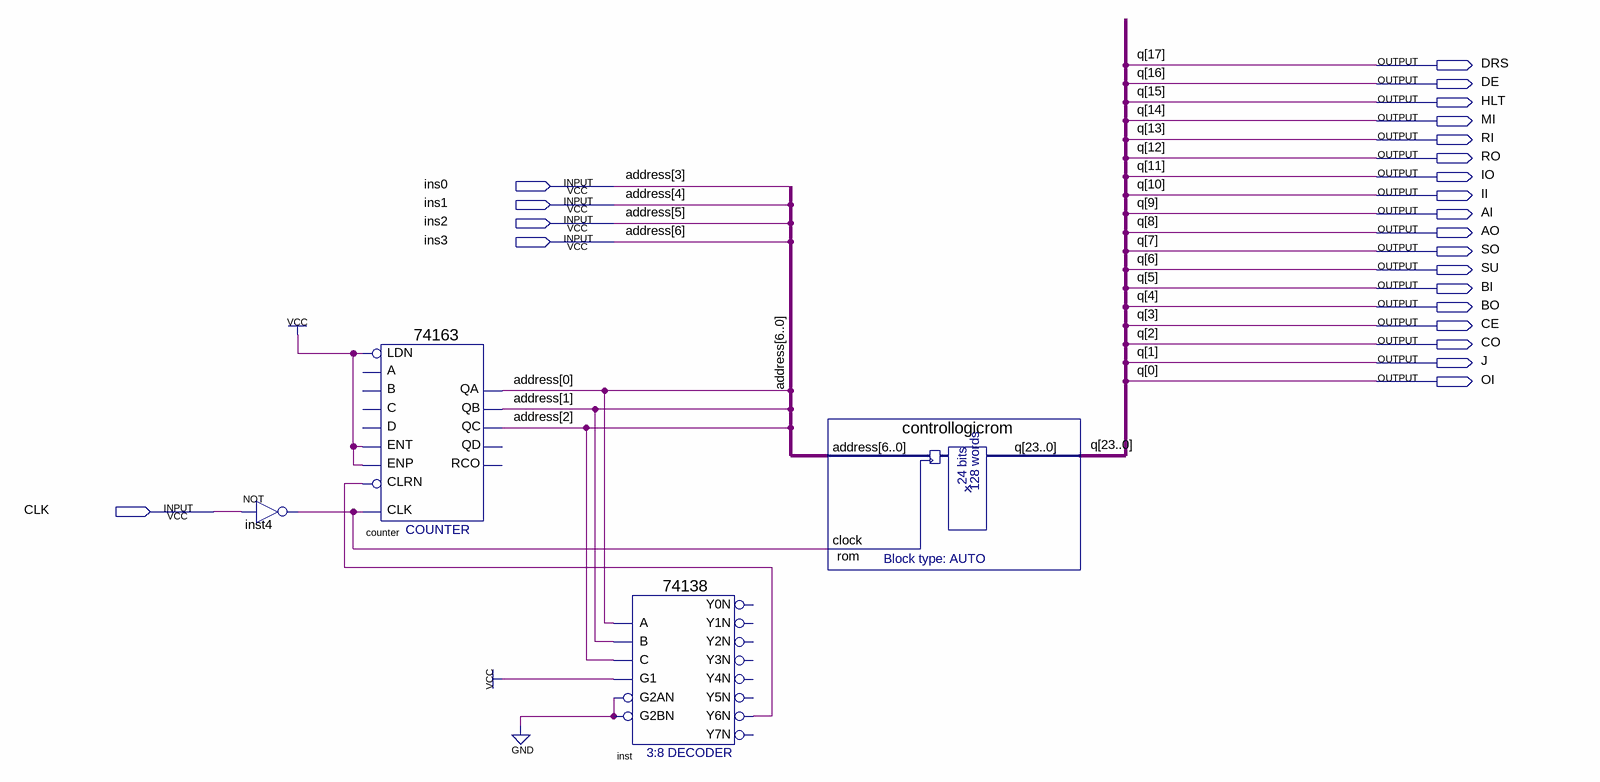
[diagram p0: schematic sheet]
// Quartus schematic controllogic.bdf as structural Verilog: 4 symbols, 23 pins
module controllogic (
  input  ins0,
  input  ins1,
  input  ins2,
  input  ins3,
  input  CLK,
  output DRS,
  output DE,
  output HLT,
  output MI,
  output RI,
  output RO,
  output IO,
  output II,
  output AI,
  output AO,
  output SO,
  output SU,
  output BI,
  output BO,
  output CE,
  output CO,
  output J,
  output OI
);

  wire inst4_out, inst_y6n;
  wire [2:0] address;
  wire [23:18] q;

  not inst4 (inst4_out, CLK);
  \74163  counter (
    .ENT(1'b1), .CLRN(inst_y6n), .CLK(inst4_out), .ENP(1'b1), .LDN(1'b1), .QA(address[0]), .QB(address[1]),
    .QC(address[2]));  // open: C, B, A, D, QD, RCO
  \74138  inst (
    .A(address[0]), .B(address[1]), .G1(1'b1), .C(address[2]), .G2AN(1'b0), .G2BN(1'b0), .Y6N(inst_y6n));  // open: Y0N, Y1N, Y2N, Y3N, Y4N, Y5N, Y7N
  controllogicrom rom (
    .address({ins3, ins2, ins1, ins0, address}), .clock(inst4_out),
    .q({q, DRS, DE, HLT, MI, RI, RO, IO, II, AI, AO, SO, SU, BI, BO, CE, CO, J, OI}));

  // Other names for the same wires on the sheet: address[6:3] = {ins3, ins2, ins1, ins0};
  //   q[17:0] = {DRS, DE, HLT, MI, RI, RO, IO, II, AI, AO, SO, SU, BI, BO, CE, CO, J, OI}
endmodule
